# EAGLE design DC Offset (EAGLE 9.6.2)
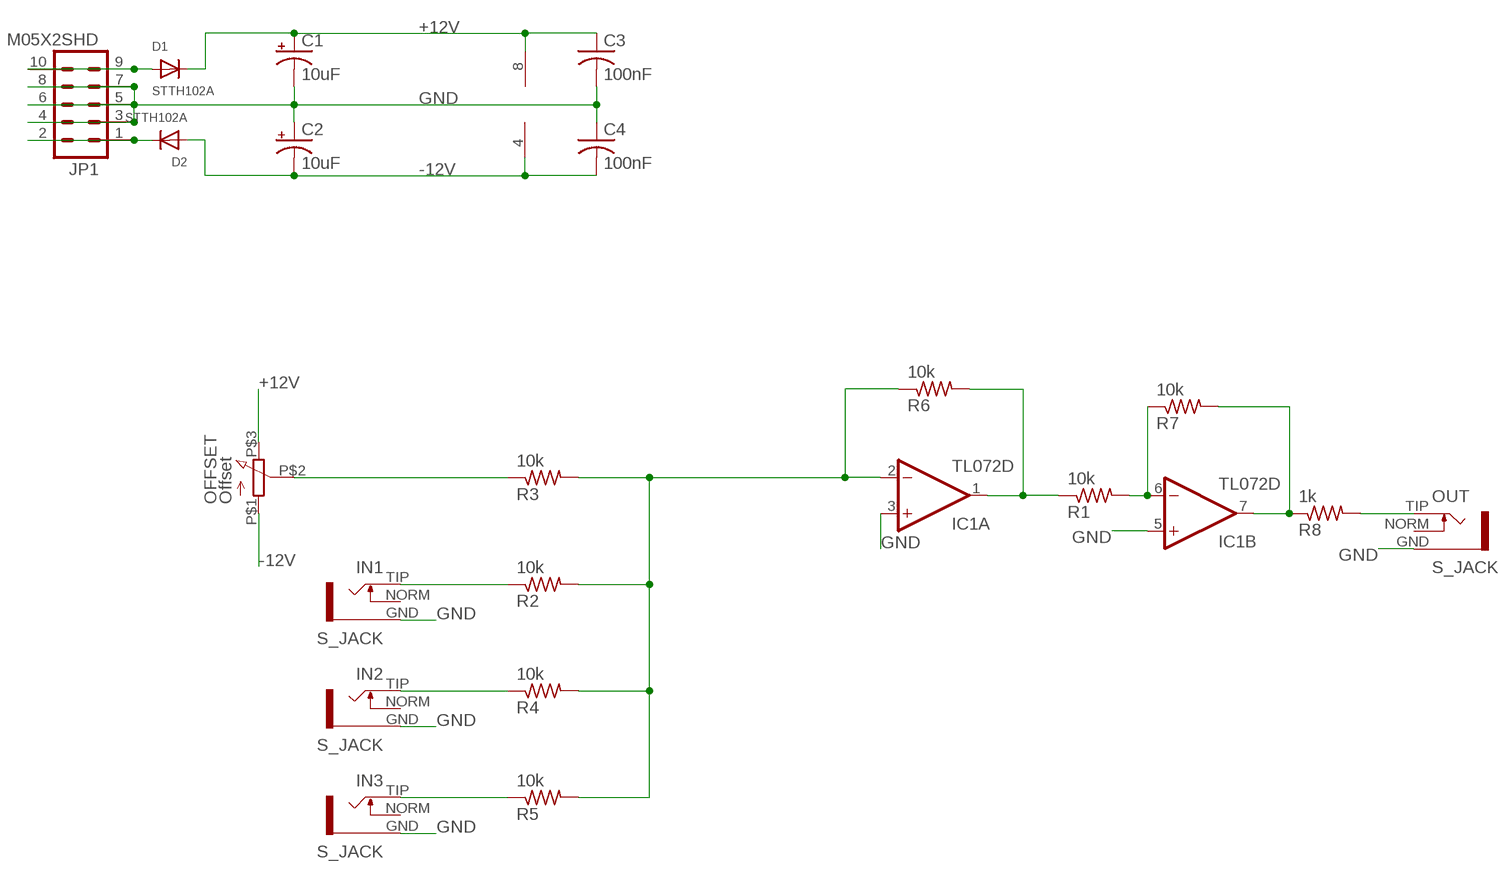
[diagram p0: schematic, sheet 1]

## Parts
C1  10uF  CPOL-US153CLV-0505  [153CLV-0505]
C2  10uF  CPOL-US153CLV-0505  [153CLV-0505]
C3  100nF  C-USC0805  [C0805]
C4  100nF  C-USC0805  [C0805]
D1  STTH102A  DIODESMA  [SMADIODE]
D2  STTH102A  DIODESMA  [SMADIODE]
IC1  TL072D  [SO08]
IN1  S_JACK  [S_JACK]
IN2  S_JACK  [S_JACK]
IN3  S_JACK  [S_JACK]
JP1  M05X2SHD  [2X5-SHROUDED]
OFFSET  Offset  Q-POT  [Q-POT]
OUT  S_JACK  [S_JACK]
R1  10k  R-US_R0805  [R0805]
R2  10k  R-US_R0805  [R0805]
R3  10k  R-US_R0805  [R0805]
R4  10k  R-US_R0805  [R0805]
R5  10k  R-US_R0805  [R0805]
R6  10k  R-US_R0805  [R0805]
R7  10k  R-US_R0805  [R0805]
R8  1k  R-US_R0805  [R0805]

## Nets
+12V: C1.+ C3.1 D1.C IC1.8(P:V+) OFFSET.P$3
-12V: C2.- C4.2 D2.A IC1.4(P:V-) OFFSET.P$1
GND: C1.- C2.+ C3.2 C4.1 IC1.3(A:+IN) IC1.5(B:+IN) IN1.GND IN2.GND IN3.GND JP1.3 JP1.4 JP1.5 JP1.6 JP1.7 JP1.8 OUT.GND
N$1: D1.A JP1.9 JP1.10
N$2: IC1.7(B:OUT) R7.2 R8.1
N$3: OUT.TIP R8.2
N$4: IC1.6(B:-IN) R1.2 R7.1
N$5: OFFSET.P$2 R3.1
N$6: IC1.2(A:-IN) R2.2 R3.2 R4.2 R5.2 R6.1
N$7: D2.C JP1.1 JP1.2
N$9: IC1.1(A:OUT) R1.1 R6.2
N$11: IN1.TIP R2.1
N$12: IN2.TIP R4.1
N$13: IN3.TIP R5.1
Unconnected: IN1.NORM IN2.NORM IN3.NORM OUT.NORM

## Library data of the parts
C1 C2 = GMSN:CPOL-US: POLARIZED CAPACITOR, American symbol
C3 C4 = GMSN:C-US: CAPACITOR, American symbol
D1 D2 = GMSN:DIODE: Diode SMADIODE - SMA Surface Mount Package 20V 1A Schottky Diode Digikey: 641-1014-6-ND DO-1N4148 - Through Hole Small Current Diode SOD-123 20V 1 A (.5mV Vf) Schottky Diode - Digikey: MBRX120TPMSCT-ND SOD-323 10V 570mA (.38mV Vf, 3ns) Schottky Diode - Digikey: ZLLS410CT-ND SOD-523 30V 30mA Schottky Diode (RB751S-40TE61) - Digikey: RB751S-40TE61CT-ND SOT23-R/W - SOT23 Package (R = Solder Paste/Reflow Ovens, W = Hand-Soldering) BAT54Film 40V 300mA - Digikey: 497-7162-1-ND
IC1 = GMSN:TL072: OP AMP
IN1-IN3 OUT = GMSN:S_JACK
JP1 = GMSN:M05X2: Header 5x2 Standard 10-pin dual row 0.1" header. Commonly used with AVR-ISP. Use with Spark Fun Electronics SKU: PRT-00778
OFFSET = GMSN:Q-POT
R1-R8 = GMSN:R-US_: RESISTOR, American symbol

## Board
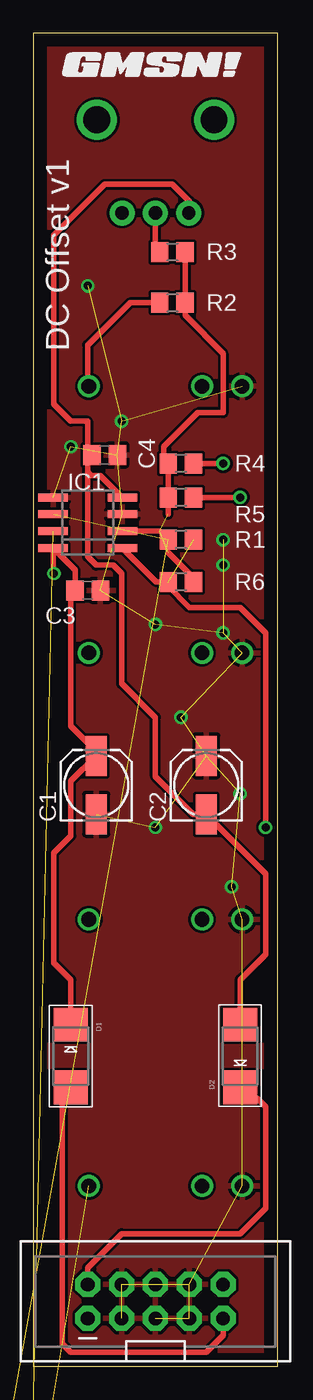
[diagram p1: board, top side]
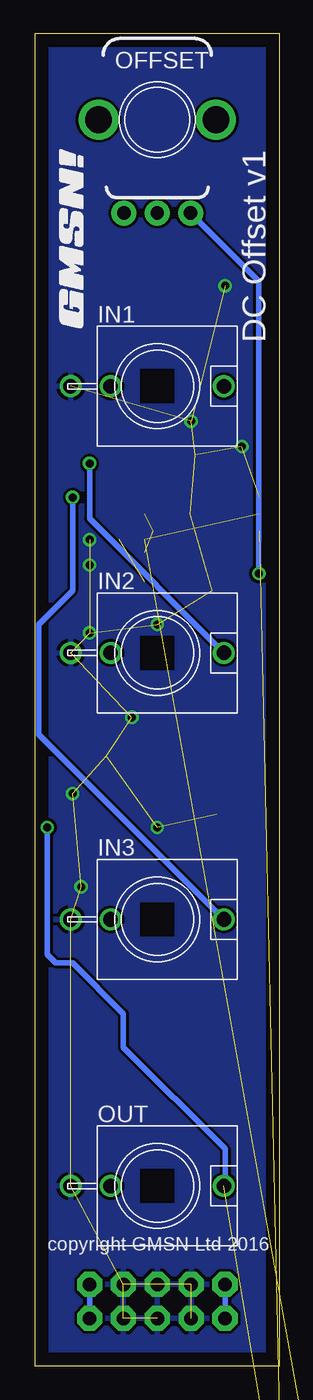
[diagram p2: board, bottom side, seen from below]

Size 18.32 x 100 mm. Coordinates in mm from the lower left corner, seen from the top.
Outline: 0,0 18.32,0 18.32,100 0,100 0,0
Copper layers (1*16): Top 0.035mm / dielectric 1.5mm / Bottom 0.035mm
Design rules "default": minimum track width 10mil, minimum drill 24mil, track to track 8mil, track to pad 8mil, pad to pad 8mil, via to via 8mil, smd to smd 8mil, copper to edge 40mil, drill to drill 8mil, minimum pad ring 10mil, minimum via ring 8mil, stop-mask expansion 4mil, vias tented up to drill 0mil, thermal gap 10mil

### Footprints (pad centres in the part's own frame; a part is rotated, then mirrored left to right if it is on the bottom)
153CLV-0505 = smd 3 x 1.6: + 2.2,0; - -2.2,0
C0805 = smd 1.3 x 1.5: 1 -0.95,0; 2 0.95,0
SMADIODE = smd 2.54 x 2.54: A 2.349,0; C -2.349,0
SO08 = smd 0.6 x 2.2: 1 -1.905,-2.6; 2 -0.635,-2.6; 3 0.635,-2.6; 4 1.905,-2.6; 5 1.905,2.6; 6 0.635,2.6; 7 -0.635,2.6; 8 -1.905,2.6
S_JACK = drill 1.1: GND 0,-6.5; NORM 0,-3.5; TIP 0,5
2X5-SHROUDED = drill 1.016 pad 1.88 octagon: 1 -1.27,5.08; 2 1.27,5.08; 3 -1.27,2.54; 4 1.27,2.54; 5 -1.27,0; 6 1.27,0; 7 -1.27,-2.54; 8 1.27,-2.54; 9 -1.27,-5.08; 10 1.27,-5.08
Q-POT = drill 1 pad 1.88: P$1 -2.5,-7; P$2 0,-7; P$3 2.5,-7 | drill 2 pad 2.68: P$4 -4.4,0; P$5 4.4,0
R0805 = smd 1.3 x 1.5: 1 -0.95,0; 2 0.95,0

### Placement (x,y rotation side)
C1  4.71,43.59 90 top
C2  12.97,43.59 90 top
C3  4.08,58.2 0 top
C4  5.35,68.36 180 top
D1  2.81,23.28 270 top
D2  15.51,23.28 90 top
IC1  4.08,63.28 90 top
IN1  9.16,73.52 270 bottom
IN2  9.16,53.52 270 bottom
IN3  9.16,33.52 270 bottom
JP1  9.16,4.86 90 top
OFFSET  9.16,93.52 0 bottom
OUT  9.16,13.52 270 bottom
R1  11.06,62.01 180 top
R2  10.43,79.79 0 top
R3  10.43,83.6 0 top
R4  11.06,67.72 180 top
R5  11.06,65.19 180 top
R6  11.06,58.83 180 top
R7  -1,-5.3 0 top  (outside the outline)
R8  -1,-11.65 0 top  (outside the outline)
U$1  [GMSN!_LOGO]  9.16,97.57 0 top
U$2  [GMSN!_LOGO]  15.51,84.87 90 bottom

### Tracks (layer width: path | path; a pad name or v marks a point on that pad's centre or on a via)
+12V  (via drill 0.6)
  Top 0.406: D1.C 2.81,28.99 1.54,30.26 1.54,38.52 2.81,39.78 2.81,43.89 C1.+ 4.71,46.14 2.81,48.04 2.81,57.88 C3.1 3.13,59.72 IC1.8 1.48,59.53 v1.54,59.47
  Bottom 0.406: v1.54,59.47 1.54,81.4 OFFSET.P$3
-12V
  Top 0.406: D2.A 15.51,28.99 17.41,30.89 17.41,36.95 C2.- 11.99,41.39 9.16,44.23 9.16,48.67 6.62,51.21 6.62,59.47 5.99,60.1 4.71,60.1 4.08,60.74 4.08,67.09 | IC1.4 5.03,66.83 4.33,66.83 4.08,67.09 | 4.08,67.09 4.08,68.04 C4.2 4.08,68.68 4.08,70.9 2.81,70.9 1.54,72.17 1.54,84.87 5.35,88.68 10.43,88.68 11.7,87.41 11.7,86.56 OFFSET.P$1
GND  (via drill 0.6)  (26 unrouted)
  other vias: 14.24,60.1 14.24,55.02 14.24,62.01 9.16,55.66 11.06,48.67 15.51,42.96 9.16,40.42 14.88,35.97 4.08,81.06 6.62,70.9 2.81,68.99
  pour Top: -3.54,100.11 21.86,100.11 21.86,-1.49 -3.54,-1.49
  pour Bottom: 0.27,100.11 18.05,100.11 18.05,-0.22 0.27,-0.22
N$1
  Top 0.406: D1.A 2.17,20.93 2.17,1.68 2.81,1.05 12.97,1.05 14.24,2.32 JP1.9
  Bottom 0.406: JP1.9 JP1.10
N$2  (2 unrouted)
N$3  (1 unrouted)
N$4  (2 unrouted)
N$5
  Top 0.406: OFFSET.P$2 9.16,83.92 R3.1
N$6  (2 unrouted)
  Top 0.406: R3.2 R2.2 11.38,78.84 14.24,75.98 14.24,71.53 12.34,71.53 9.79,68.99 9.79,68.05 R4.2 R5.2 10.12,63.91 | IC1.2 9.48,62.64 | 10.12,61.05 11.7,59.47 11.7,59.15 R6.1
N$7
  Top 0.406: JP1.2 4.08,7.4 6.62,9.94 15.51,9.94 17.41,11.84 17.41,19.46 16.78,20.1 16.34,20.1 D2.C
  Bottom 0.406: JP1.1 JP1.2
N$9  (via drill 0.6)  (1 unrouted)
  Top 0.406: IC1.1 9.22,58.83 R6.2 10.12,58.52 11.7,56.93 15.51,56.93 17.41,55.02 v17.41,40.42
  Bottom 0.406: v17.41,40.42 17.41,30.89 16.78,30.26 15.51,30.26 11.7,26.45 11.7,23.91 4.08,16.29 4.08,13.6
N$11
  Top 0.406: R2.1 7.26,79.79 4.08,76.61 4.08,73.44 IN1.TIP
N$12  (via drill 0.6)
  Top 0.406: R4.1 v14.24,67.72
  Bottom 0.406: v14.24,67.72 14.24,63.6 IN2.TIP
N$13  (via drill 0.6)
  Top 0.406: R5.1 v15.51,65.19
  Bottom 0.406: v15.51,65.19 15.51,58.2 18.05,55.66 18.05,47.41 IN3.TIP

### Text on the board
tNames: DC Offset v1
bNames: DC Offset v1 | copyright GMSN Ltd 2016